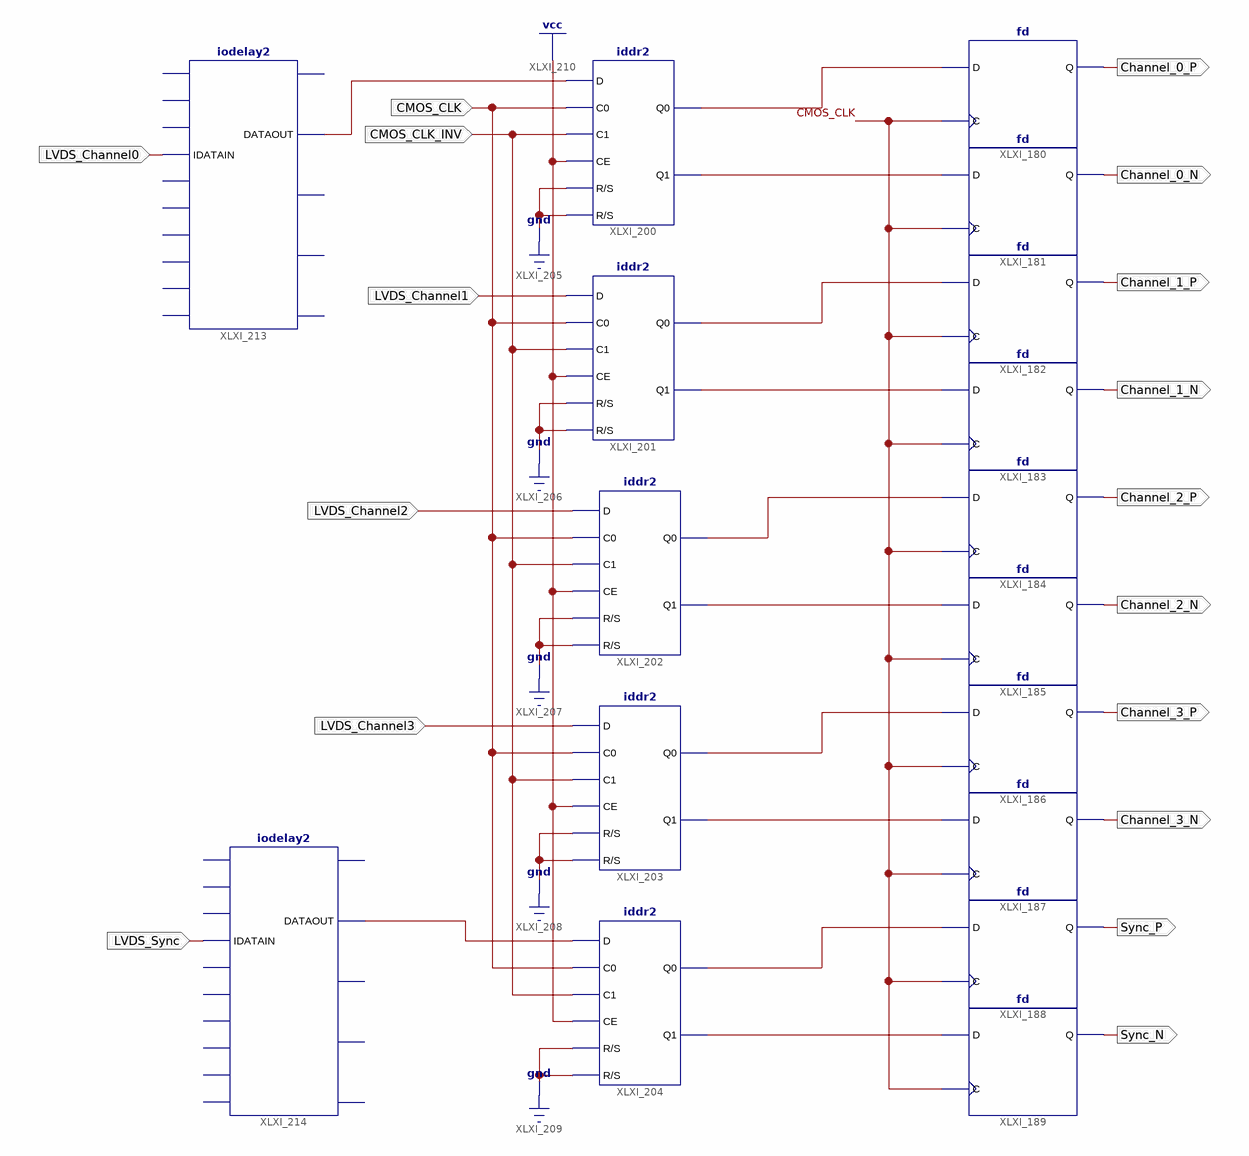
[diagram p0: schematic sheet 1]
// Xilinx ISE schematic LVDS_IDDR.sch (spartan6) as structural Verilog: 17 symbols, 17 ports
module LVDS_IDDR (
  input  LVDS_Channel1,
  input  LVDS_Channel2,
  input  LVDS_Channel3,
  input  CMOS_CLK,
  input  CMOS_CLK_INV,
  input  LVDS_Channel0,
  input  LVDS_Sync,
  output Channel_0_P,
  output Channel_0_N,
  output Channel_1_P,
  output Channel_1_N,
  output Channel_2_P,
  output Channel_2_N,
  output Channel_3_P,
  output Channel_3_N,
  output Sync_P,
  output Sync_N
);

  wire XLXN_5, XLXN_6, XLXN_7, XLXN_8, XLXN_9, XLXN_10, XLXN_11, XLXN_12, XLXN_13, XLXN_14, XLXN_47, XLXN_49;

  fd XLXI_180 (.C(CMOS_CLK), .D(XLXN_5), .Q(Channel_0_P));
  fd XLXI_181 (.C(CMOS_CLK), .D(XLXN_6), .Q(Channel_0_N));
  fd XLXI_182 (.C(CMOS_CLK), .D(XLXN_7), .Q(Channel_1_P));
  fd XLXI_183 (.C(CMOS_CLK), .D(XLXN_8), .Q(Channel_1_N));
  fd XLXI_184 (.C(CMOS_CLK), .D(XLXN_10), .Q(Channel_2_P));
  fd XLXI_185 (.C(CMOS_CLK), .D(XLXN_9), .Q(Channel_2_N));
  fd XLXI_186 (.C(CMOS_CLK), .D(XLXN_12), .Q(Channel_3_P));
  fd XLXI_187 (.C(CMOS_CLK), .D(XLXN_11), .Q(Channel_3_N));
  fd XLXI_188 (.C(CMOS_CLK), .D(XLXN_14), .Q(Sync_P));
  fd XLXI_189 (.C(CMOS_CLK), .D(XLXN_13), .Q(Sync_N));
  iddr2 XLXI_200 (
    .D(XLXN_47), .C0(CMOS_CLK), .C1(CMOS_CLK_INV), .CE(1'b1), .R(1'b0), .S(1'b0), .Q0(XLXN_5), .Q1(XLXN_6));
  iddr2 XLXI_201 (
    .D(LVDS_Channel1), .C0(CMOS_CLK), .C1(CMOS_CLK_INV), .CE(1'b1), .R(1'b0), .S(1'b0), .Q0(XLXN_7),
    .Q1(XLXN_8));
  iddr2 XLXI_202 (
    .D(LVDS_Channel2), .C0(CMOS_CLK), .C1(CMOS_CLK_INV), .CE(1'b1), .R(1'b0), .S(1'b0), .Q0(XLXN_10),
    .Q1(XLXN_9));
  iddr2 XLXI_203 (
    .D(LVDS_Channel3), .C0(CMOS_CLK), .C1(CMOS_CLK_INV), .CE(1'b1), .R(1'b0), .S(1'b0), .Q0(XLXN_12),
    .Q1(XLXN_11));
  iddr2 XLXI_204 (
    .D(XLXN_49), .C0(CMOS_CLK), .C1(CMOS_CLK_INV), .CE(1'b1), .R(1'b0), .S(1'b0), .Q0(XLXN_14), .Q1(XLXN_13));
  iodelay2 #(.IDELAY_TYPE("FIXED"), .DELAY_SRC("IDATAIN"), .IDELAY_VALUE(10), .DATA_RATE("DDR")) XLXI_213 (
    .IDATAIN(LVDS_Channel0), .DATAOUT(XLXN_47));  // open: CAL, CE, CLK, INC, IOCLK0, IOCLK1, ODATAIN, RST, T, BUSY, DATAOUT2, DOUT, TOUT
  iodelay2 #(.IDELAY_TYPE("FIXED"), .DELAY_SRC("IDATAIN"), .IDELAY_VALUE(10), .DATA_RATE("DDR")) XLXI_214 (
    .IDATAIN(LVDS_Sync), .DATAOUT(XLXN_49));  // open: CAL, CE, CLK, INC, IOCLK0, IOCLK1, ODATAIN, RST, T, BUSY, DATAOUT2, DOUT, TOUT
endmodule
